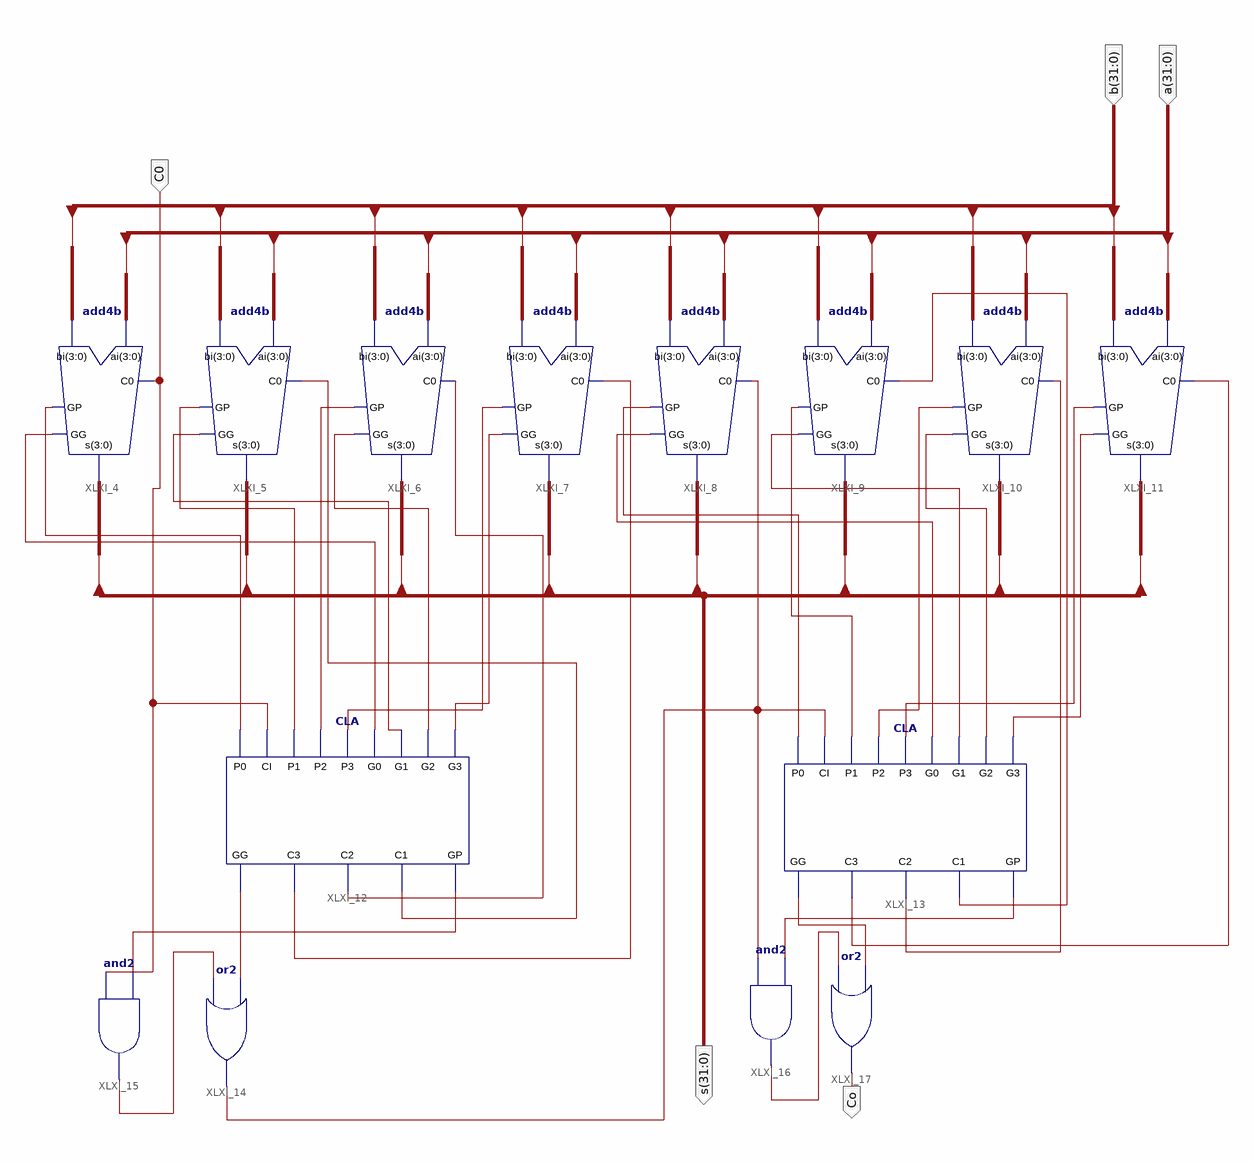
[diagram p0: schematic sheet 1]
// Xilinx ISE schematic ADC32.sch (kintex7) as structural Verilog: 14 symbols, 5 ports
module ADC32 (
  input  C0,
  input  [31:0] a,
  input  [31:0] b,
  output [31:0] s,
  output Co
);

  wire XLXN_2, XLXN_3, XLXN_4, XLXN_6, XLXN_7, XLXN_8, XLXN_19, XLXN_20, XLXN_21, XLXN_22, XLXN_23, XLXN_24,
       XLXN_25, XLXN_26, XLXN_37, XLXN_38, XLXN_39, XLXN_41, XLXN_42, XLXN_43, XLXN_44, XLXN_45, XLXN_46,
       XLXN_47, XLXN_48, XLXN_49, XLXN_50, XLXN_51, XLXN_52;

  add4b XLXI_4 (.ai(a[3:0]), .GP(XLXN_26), .s(s[3:0]), .GG(XLXN_22), .C0(C0), .bi(b[3:0]));
  add4b XLXI_5 (.ai(a[7:4]), .GP(XLXN_25), .s(s[7:4]), .GG(XLXN_21), .C0(XLXN_6), .bi(b[7:4]));
  add4b XLXI_6 (.ai(a[11:8]), .GP(XLXN_24), .s(s[11:8]), .GG(XLXN_20), .C0(XLXN_7), .bi(b[11:8]));
  add4b XLXI_7 (.ai(a[15:12]), .GP(XLXN_23), .s(s[15:12]), .GG(XLXN_19), .C0(XLXN_8), .bi(b[15:12]));
  add4b XLXI_8 (.ai(a[19:16]), .GP(XLXN_49), .s(s[19:16]), .GG(XLXN_45), .C0(XLXN_41), .bi(b[19:16]));
  add4b XLXI_9 (.ai(a[23:20]), .GP(XLXN_48), .s(s[23:20]), .GG(XLXN_44), .C0(XLXN_50), .bi(b[23:20]));
  add4b XLXI_10 (.ai(a[27:24]), .GP(XLXN_47), .s(s[27:24]), .GG(XLXN_43), .C0(XLXN_51), .bi(b[27:24]));
  add4b XLXI_11 (.ai(a[31:28]), .GP(XLXN_46), .s(s[31:28]), .GG(XLXN_42), .C0(XLXN_52), .bi(b[31:28]));
  CLA XLXI_12 (
    .G3(XLXN_19), .G2(XLXN_20), .G1(XLXN_21), .G0(XLXN_22), .P3(XLXN_23), .P2(XLXN_24), .P1(XLXN_25),
    .CI(C0), .P0(XLXN_26), .GP(XLXN_2), .C1(XLXN_6), .C2(XLXN_7), .C3(XLXN_8), .GG(XLXN_3));
  CLA XLXI_13 (
    .G3(XLXN_42), .G2(XLXN_43), .G1(XLXN_44), .G0(XLXN_45), .P3(XLXN_46), .P2(XLXN_47), .P1(XLXN_48),
    .CI(XLXN_41), .P0(XLXN_49), .GP(XLXN_39), .C1(XLXN_50), .C2(XLXN_51), .C3(XLXN_52), .GG(XLXN_38));
  or XLXI_14 (XLXN_41, XLXN_4, XLXN_3);
  and XLXI_15 (XLXN_4, C0, XLXN_2);
  and XLXI_16 (XLXN_37, XLXN_41, XLXN_39);
  or XLXI_17 (Co, XLXN_37, XLXN_38);
endmodule
